# Altium schematic sheet Power.SchDoc
size Letter; SheetNumber: 4; SheetTotal: 8
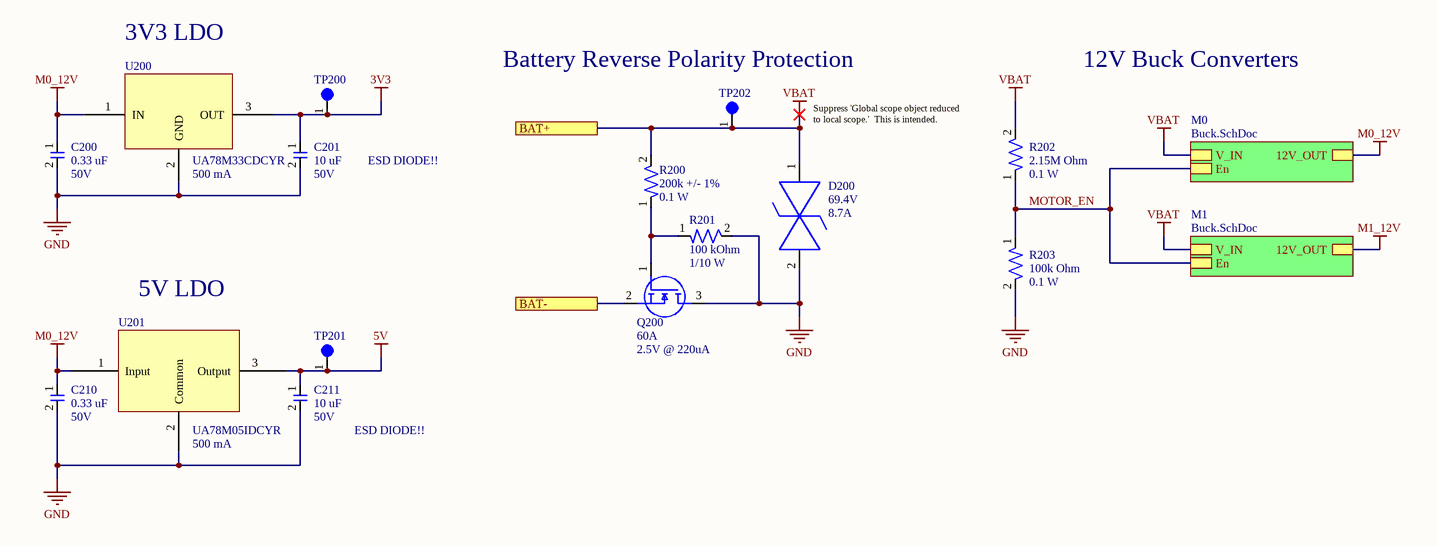
[diagram p0: Power.SchDoc]

## Parts
C200  Capacitance: 0.33 uF  Voltage: 50V  [CAP-0603]  (hidden comment: CGA3E3X7R1H334K080AB)
C201  Capacitance: 10 uF  Voltage Rating: 50V  [CAP-1206]  (hidden comment: CL31B106KBHNNNE)
C210  Capacitance: 0.33 uF  Voltage: 50V  [CAP-0603]  (hidden comment: CGA3E3X7R1H334K080AB)
C211  Capacitance: 10 uF  Voltage Rating: 50V  [CAP-1206]  (hidden comment: CL31B106KBHNNNE)
D200  Vclamp: 69.4V  Peak pulser current: 8.7A  [DO-214AA (SMBJ)]  (hidden comment: SMBJE43CAH)
Q200  Drain Current: 60A  Vgs: 2.5V @ 220uA  [NMOS-8PowerVDFN]  (hidden comment: TPH7R006PL,L1Q)
R200  Resistance: 200k +/- 1%  Power Rating: 0.1 W  [RES-0603]  (hidden comment: ERJ-3EKF2003V)
R201  Resistance: 100 kOhm  Power: 1/10 W  [RES-0603]  (hidden comment: RC0603FR-07100KL)
R202  Resistance: 2.15M Ohm  Power: 0.1 W  [RES-0603]  (hidden comment: RC0603FR-072M15L)
R203  Resistance: 100k Ohm  Power: 0.1 W  [RES-0603]  (hidden comment: RC0603FR-07100KL)
TP200  5003  [TEST-POINT-0001]  (value not drawn)
TP201  5003  [TEST-POINT-0001]  (value not drawn)
TP202  5003  [TEST-POINT-0001]  (value not drawn)
U200  UA78M33CDCYR  Current: 500 mA  [IC-SOT-223-4]
U201  UA78M05IDCYR  Current: 500 mA  [IC-SOT-223-4]

## Sub-sheets
M0 = Buck.SchDoc: En, 12V_OUT, V_IN
M1 = Buck.SchDoc: En, 12V_OUT, V_IN

## Ports
BAT+, BAT-

## Nets
3V3: C201.1 TP200.1 U200.3(OUT)
5V: C211.1 TP201.1 U201.3(Output)
GND: C200.2 C201.2 C210.2 C211.2 D200.2 Q200.3(D) R201.2 R203.2 U200.2(GND) U201.2(Common)
M0_12V: C200.1 C210.1 U200.1(IN) U201.1(Input) ; sheet M0/12V_OUT
M1_12V: sheet M1/12V_OUT
VBAT: D200.1 R200.2 R202.2 TP202.1 ; port BAT+, sheet M0/V_IN, sheet M1/V_IN
BAT-: Q200.2(S) ; port BAT-
MOTOR_EN: R202.1 R203.1 ; sheet M0/En, sheet M1/En
NetQ200_1: Q200.1(G) R200.1 R201.1

## Notes on the sheet
- 3V3 LDO
- (near TP202) Battery Reverse Polarity Protection
- 12V Buck Converters
- Suppress 'Global scope object reduced to local scope.'  This is intended.
- ESD DIODE!!
- 5V LDO

## Library data of the parts
C200 C210 = CAP-0.33uF-0001: 0.33 µF ±10% 50V Ceramic Capacitor X7R 0603 (1608 Metric); Manufacturer: TDK Corporation; Manufacturer Part Number: CGA3E3X7R1H334K080AB; Tolerance: 10%; Temperature Coefficient: X7R
C201 C211 = CAP-10U-0001: 10 µF ±10% 50V Ceramic Capacitor X7R 1206 (3216 Metric); Manufacturer: Samsung Electro-Mechanics; Assembled?: no; Manufacturer Part Number: CL31B106KBHNNNE; Temperature Coefficient: X7R; Tolerance: 10%; Package Size: 1206
D200 = DIO-69.4V-0001: 69.4V Clamp 8.7A Ipp Tvs Diode Surface Mount DO-214AA (SMBJ); Channels: Bidirectional; Breakdown VOltage: 47.8V; Reverse working maximum voltage: 43V; Package: DO-214AA (SMBJ)
Q200 = NMOS-60A-0001: N-Channel 60 V 60A (Tc) 81W (Tc) Surface Mount 8-SOP Advance (5x5); Vdss: 60V; Vgs(Max): 20V; Package: 8-PowerVDFN
R200 = RES-200K-0001: 200 kOhms ±1% 0.1W, 1/10W Chip Resistor 0603 (1608 Metric) Automotive AEC-Q200 Thick Film; Manufacturer: Panasonic Electronic Components; Assembled?: Yes; MFP: ERJ-3EKF2003V; Package SIze: 0603
R201 = RES-100K-0003: 100 kOhms ±1% 0.1W, 1/10W Chip Resistor 0603 (1608 Metric) Moisture Resistant Thick Film; Tolerance: +/- 1%; Assembled?: No; Package Size: 0603
R202 = RES-2.15M-0001: 2.15 MOhms ±1% 0.1W, 1/10W Chip Resistor 0603 (1608 Metric) Moisture Resistant Thick Film; Assembled?: No; Tolerance: 1%; Package Size: 0603
R203 = RES-100K-0003: 100 kOhms ±1% 0.1W, 1/10W Chip Resistor 0603 (1608 Metric) Moisture Resistant Thick Film; Assembled?: No; Tolerance: 1%; Package Size: 0603
TP200-TP202 = TEST-POINT-0001: Oranange PC Test Point, Miniature Phoisphor Bronze Silver Plating Through Hole Mounting Type
U200 = IC-LDO-3.3V-0002: Linear Voltage Regulator IC Positive Fixed 1 Output 500mA SOT-223-4; Vin: 25V; Vout: 3.3V; Package: SOT-223-4
U201 = IC-LDO-5V-0003: Linear Voltage Regulator IC Positive Fixed 1 Output 500mA SOT-223-4; Manufacturer: Texas Instruments; Assembled?: no; Manufacturer Part Number: UA78M05IDCYR; Package Size: SOT223-4; Type: Low dropout (LDO)